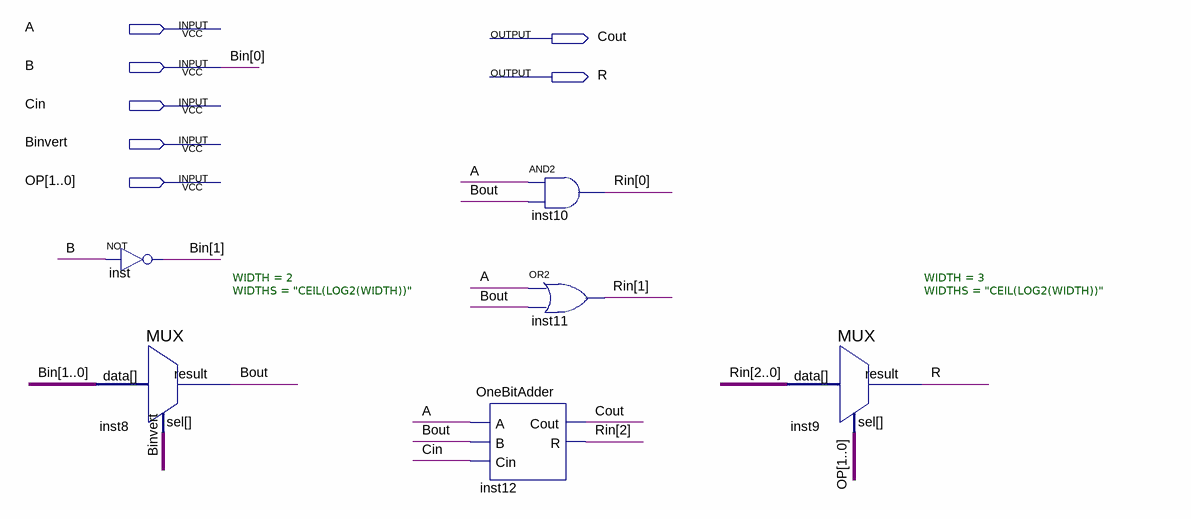
[diagram p0: schematic sheet]
// Quartus schematic OneBitALU.bdf as structural Verilog: 6 symbols, 7 pins
module OneBitALU (
  input  A,
  input  B,
  input  Cin,
  input  Binvert,
  input  [1:0] OP,
  output Cout,
  output R
);

  wire Bout;
  wire [1:1] Bin;
  wire [2:0] Rin;

  not inst (Bin[1], B);
  MUX #(.WIDTH(2), .WIDTHS("CEIL(LOG2(WIDTH))")) inst8 (.data({Bin[1], B}), .sel(Binvert), .result(Bout));
  OneBitAdder inst12 (.A(A), .B(Bout), .Cin(Cin), .Cout(Cout), .R(Rin[2]));
  and inst10 (Rin[0], A, Bout);
  or inst11 (Rin[1], A, Bout);
  MUX #(.WIDTH(3), .WIDTHS("CEIL(LOG2(WIDTH))")) inst9 (.data(Rin), .sel(OP), .result(R));

  // Other names for the same wires on the sheet: Bin[0] = B
endmodule
